# EAGLE design 30x70-motor-controller-0.2 (EAGLE 7.7.0)

## Sheet 1 of 2
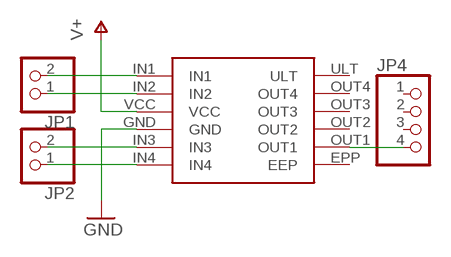
[diagram p0: schematic, sheet 1]

### Parts
JP1  PINHD-1X2/90  [1X02/90]
JP2  PINHD-1X2/90  [1X02/90]
JP4  PINHD-1X4/90  [1X04/90]
U$1  DRV8833-MODULE  [DRV8833-BRKOUT]

### Nets
GND: U$1.GND ; also sheet 2
N$1: JP2.2 U$1.IN3
N$2: JP2.1 U$1.IN4
N$3: JP1.2 U$1.IN1
N$4: JP1.1 U$1.IN2
N$14: JP4.4 U$1.OUT1
V+: U$1.VCC ; also sheet 2
Unconnected: JP4.1 JP4.2 JP4.3 U$1.EPP(EEP) U$1.OUT2 U$1.OUT3 U$1.OUT4 U$1.ULT

## Sheet 2 of 2
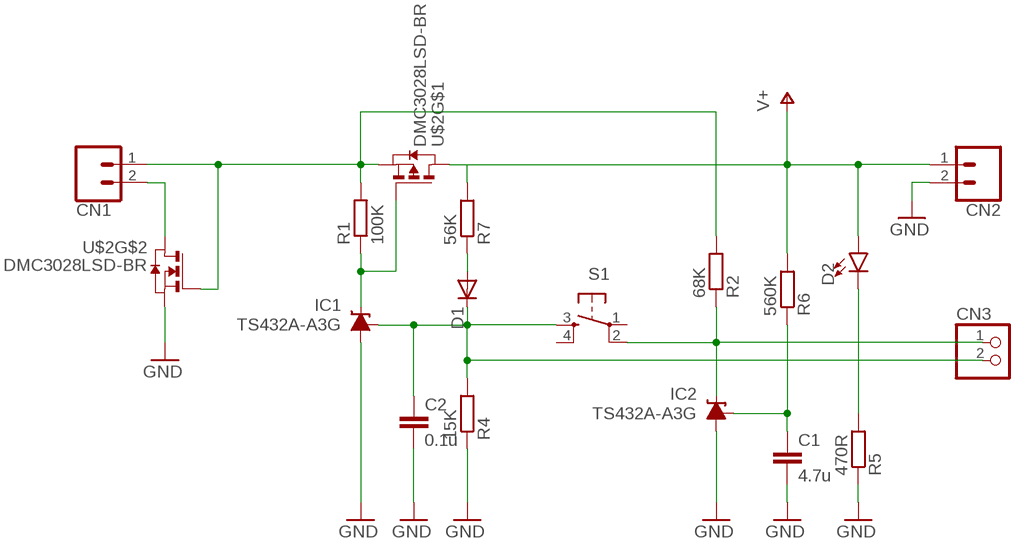
[diagram p1: schematic, sheet 2]

### Parts
C1  4.7u  C-EU025-025X050  [C025-025X050]
C2  0.1u  C-EU025-024X044  [C025-024X044]
CN1  CONN_02-JST-XTH  [JST-2-XTH]
CN2  CONN_02-JST-XTH  [JST-2-XTH]
CN3  PINHD-1X2/90  [1X02/90]
D1  DIODE-D-2.5  [D-2.5]
D2  LED-3MM-NO_SILK  [LED_3MM-NS]
IC1  TS432A-A3G  [TO92-LINE]
IC2  TS432A-A3G  [TO92-LINE]
R1  100K  R-EU_0204/2V  [0204V]
R2  68K  R-EU_0207/15  [0207/15]
R4  15K  R-EU_0204/2V  [0204V]
R5  470R  R-EU_0204/2V  [0204V]
R6  560K  R-EU_0204/2V  [0204V]
R7  56K  R-EU_0204/7  [0204/7]
S1  PROTO-MICRO-SWITCH  [B3F-10XX-PROTO]
U$2  DMC3028LSD-BR  [DIL8-BREAKOUT]

### Nets
GND: C1.2 C2.2 CN2.2 IC1.2(A) IC2.2(A) R4.1 R5.1 U$2.1(S) ; also sheet 1
N$5: CN1.1 R1.2 R2.2 U$2.2(G) U$2.3(S)
N$6: IC1.1(C) R1.1 U$2.4(G)
N$7: CN1.2 U$2.7(D) U$2.8(D)
N$8: C2.1 CN3.2 D1.C IC1.3(FB) R4.2 S1.3(S)
N$9: CN3.1 IC2.1(C) R2.1 S1.2(P1)
N$10: C1.1 IC2.3(FB) R6.1
N$13: D1.A R7.1
N$17: D2.K(C) R5.2
V+: CN2.1 D2.A R6.2 R7.2 U$2.5(D) U$2.6(D) ; also sheet 1
Unconnected: S1.1(P) S1.4(S1)

## Library data of the parts
C1 C2 = resistor:C-EU: CAPACITOR, European symbol
CN1 CN2 = assorted:CONN_02: Multi connection point. Often used as Generic Header-pin footprint for 0.1 inch spaced/style header connections On any of the 0.1 inch spaced packages, you can populate with these: Break Away Headers - Straight <https://www.sparkfun.com/products/116> (PRT-00116) Break Away Male Headers - Right Angle <https://www.sparkfun.com/products/553> (PRT-00553) Female Headers <https://www.sparkfun.com/products/115> (PRT-00115) Break Away Headers - Machine Pin <https://www.sparkfun.com/products/117> (PRT-00117) Break Away Female Headers - Swiss Machine Pin <https://www.sparkfun.com/products/743> (PRT-00743) For SCREWTERMINALS and SPRING TERMINALS visit here: Screw Terimnals on SparkFun.com <https://www.sparkfun.com/search/results?term=Screw+Terminals> (5mm/3.5mm/2.54mm spacing) This device is also useful as a general connection point to wire up your design to another part of your project. Our various solder wires solder well into these plated through hole pads. Hook-Up Wire - Assortment (Stranded, 22 AWG) <https://www.sparkfun.com/products/11375> (PRT-11375) Hook-Up Wire - Assortment (Solid Core, 22 AWG) <https://www.sparkfun.com/products/11367> (PRT-11367) View the entire wire category on our website here <https://www.sparkfun.com/categories/141> Special notes: Molex polarized connector foot print use with: PRT-08233 with associated crimp pins and housings. 2.54_SCREWTERM for use with PRT-10571. 3.5mm Screw Terminal footprints for PRT-08084 5mm Screw Terminal footprints for use with PRT-08432
CN3 JP1 JP2 = pinhead:PINHD-1X2: PIN HEADER
D1 = diode:DIODE-: DIODE
D2 = SparkFun-LED:LED: LED (Generic) Standard schematic elements and footprints for 5mm, 3mm, 1206, and 0603 sized LEDs. Generic LEDs with no color specified.
IC1 IC2 = assorted:TS432A: Shunt regulator 1.24V 1% 0.8uA-100mA 18V
JP4 = pinhead:PINHD-1X4: PIN HEADER
R1 R2 R4-R7 = resistor:R-EU_: RESISTOR, European symbol
S1 = assorted:PROTO-MICRO-SWITCH: OMRON SWITCH
U$1 = assorted:DRV8833-MODULE
U$2 = assorted:DMC3028LSD

## Board
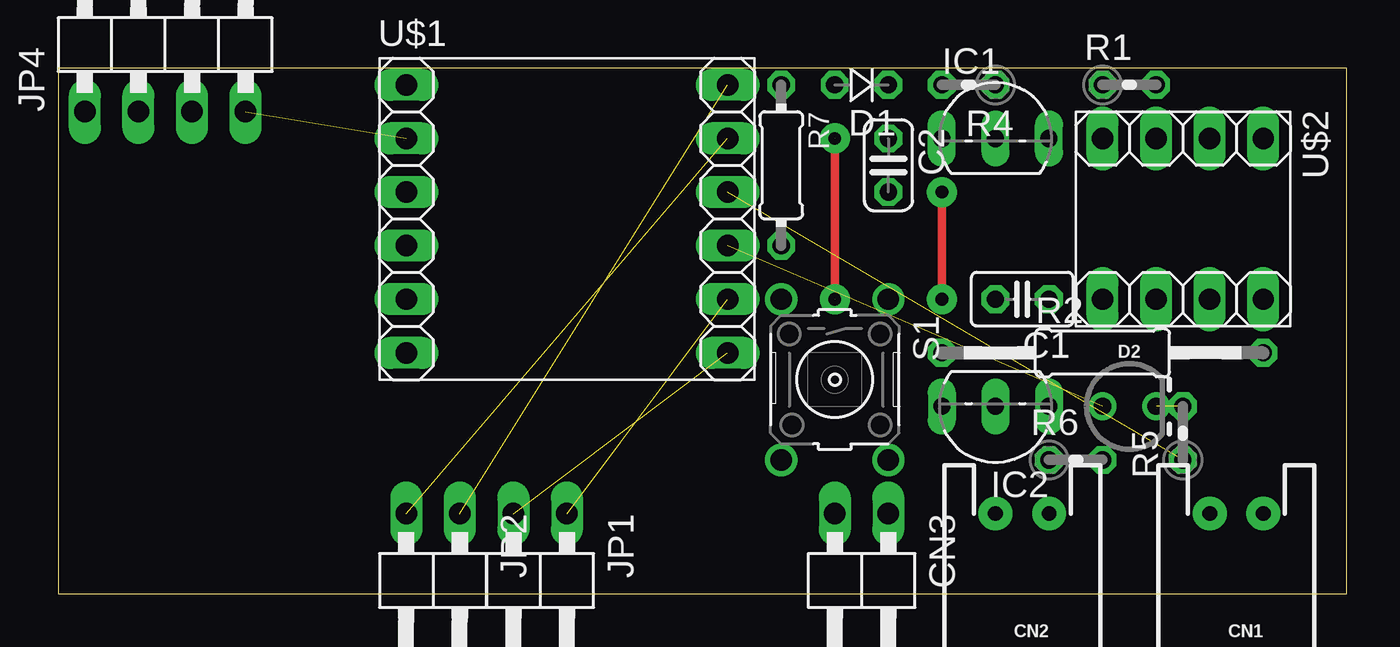
[diagram p2: board, top side]
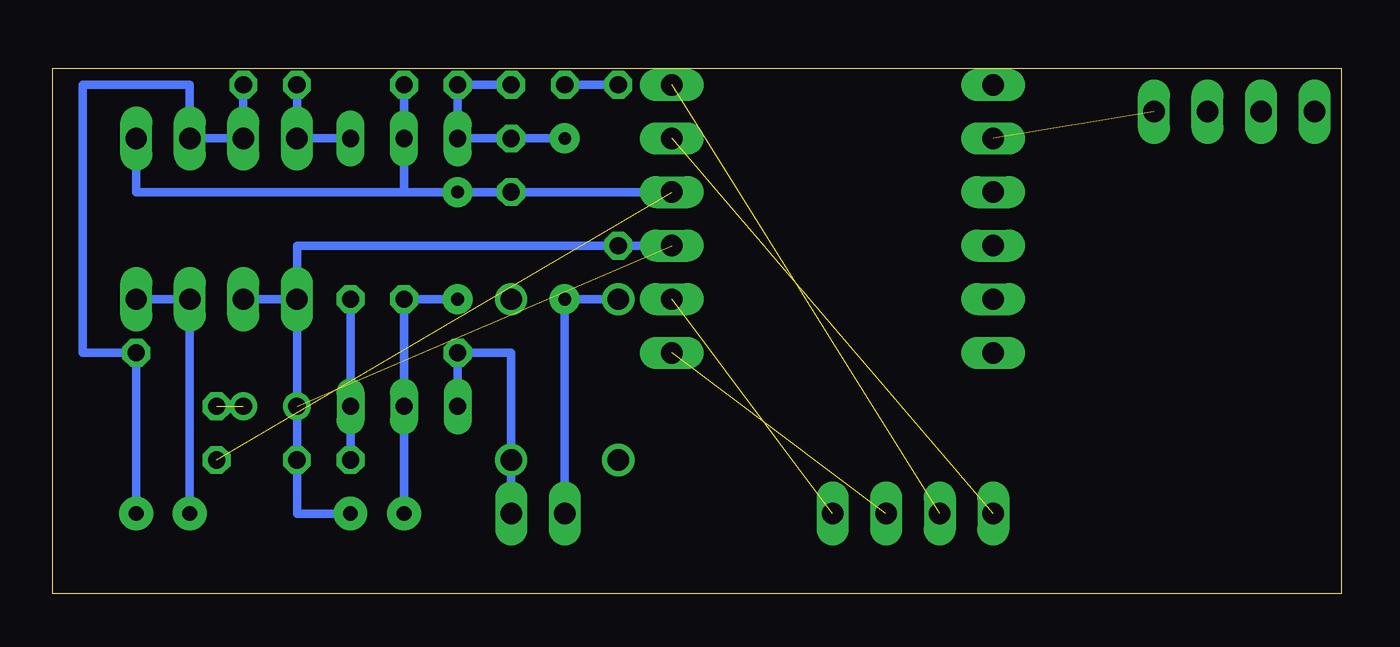
[diagram p3: board, bottom side, seen from below]

Size 61.11 x 24.92 mm. Coordinates in mm from the lower left corner, seen from the top.
Outline: 0,0 61.11,0 61.11,24.92 0,24.92 0,0
Copper layers (1*16): Top 0.035mm / dielectric 1.5mm / Bottom 0.035mm
Design rules "default": minimum track width 10mil, minimum drill 24mil, track to track 8mil, track to pad 8mil, pad to pad 8mil, via to via 8mil, smd to smd 8mil, copper to edge 40mil, drill to drill 8mil, minimum pad ring 10mil, minimum via ring 8mil, stop-mask expansion 4mil, vias tented up to drill 0mil, thermal gap 10mil

### Footprints (pad centres in the part's own frame; a part is rotated, then mirrored left to right if it is on the bottom)
C025-025X050 = drill 0.813 octagon: 1 -1.27,0; 2 1.27,0
C025-024X044 = drill 0.813 octagon: 1 -1.27,0; 2 1.27,0
JST-2-XTH = drill 0.7 pad 1.6: 1 -1.27,0; 2 1.27,0
1X02/90 = drill 1.016 long: 1 -1.27,-3.81; 2 1.27,-3.81
D-2.5 = drill 0.813 octagon: A 1.27,0; C -1.27,0
LED_3MM-NS = drill 0.813: A -1.27,0; K 1.27,0
TO92-LINE = drill 0.813 long: 1 2.54,0; 2 0,0; 3 -2.54,0
1X04/90 = drill 1.016 long: 1 -3.81,-3.81; 2 -1.27,-3.81; 3 1.27,-3.81; 4 3.81,-3.81
0204V = drill 0.813 octagon: 1 -1.27,0; 2 1.27,0
0207/15 = drill 0.813 octagon: 1 -7.62,0; 2 7.62,0
0204/7 = drill 0.813 octagon: 1 -3.81,0; 2 3.81,0
B3F-10XX-PROTO = drill 1.016: 1 -3.81,2.54; 2 3.81,2.54; 3 -3.81,-2.54; 4 3.81,-2.54
DRV8833-BRKOUT = drill 1.016 long: EPP -7.62,6.35; GND 7.62,1.27; IN1 7.62,-6.35; IN2 7.62,-3.81; IN3 7.62,3.81; IN4 7.62,6.35; OUT1 -7.62,3.81; OUT2 -7.62,1.27; OUT3 -7.62,-1.27; OUT4 -7.62,-3.81; ULT -7.62,-6.35; VCC 7.62,-1.27
DIL8-BREAKOUT = drill 1.016 long: 1 -3.81,3.81; 2 -3.81,1.27; 3 -3.81,-1.27; 4 -3.81,-3.81; 5 3.81,-3.81; 6 3.81,-1.27; 7 3.81,1.27; 8 3.81,3.81

### Placement (x,y rotation side)
C1  45.72,13.97 180 top
C2  39.37,20.32 270 top
CN1  55.88,3.81 180 top
CN2  45.72,3.81 180 top
CN3  38.1,0 180 top
D1  38.1,24.13 180 top
D2  50.8,8.89 0 top
IC1  44.45,21.59 0 top
IC2  44.45,8.89 180 top
JP1  22.86,0 180 top
JP2  17.78,0 180 top
JP4  5.08,26.67 0 top
R1  50.8,24.13 0 top
R2  49.53,11.43 0 top
R4  43.18,24.13 180 top
R5  53.34,7.62 90 top
R6  48.26,6.35 0 top
R7  34.29,20.32 270 top
S1  36.83,10.16 270 top
U$1  24.13,17.78 0 top
U$2  53.34,17.78 270 top

### Tracks (layer width: path | path; a pad name or v marks a point on that pad's centre or on a via)
GND  (via drill 0.6 pad 1.42)  (1 unrouted)
  Top 0.406: v41.91,19.05 v41.91,13.97
  Bottom 0.406: U$2.1 57.15,19.05 v41.91,19.05 C2.2 | C2.2 44.45,19.05 IC1.2 R4.1 | CN2.2 IC2.2 C1.2 v41.91,13.97 | U$1.GND C2.2
N$1  (1 unrouted)
N$2  (1 unrouted)
N$3  (1 unrouted)
N$4  (1 unrouted)
N$5
  Bottom 0.406: R1.2 U$2.3 U$2.2 54.61,24.13 59.69,24.13 59.69,11.43 R2.2 CN1.1
N$6
  Bottom 0.406: R1.1 U$2.4 IC1.1
N$7
  Bottom 0.406: U$2.8 U$2.7 CN1.2
N$8  (2 unrouted)
  Top 0.406: 36.83,21.59 36.83,13.97
  Bottom 0.406: D1.C R4.2 IC1.3 C2.1 36.83,21.59 | S1.3 36.83,13.97 CN3.2
N$9
  Bottom 0.406: IC2.1 R2.1 39.37,11.43 S1.2 CN3.1
N$10
  Bottom 0.406: C1.1 R6.1 IC2.3
N$13
  Bottom 0.406: R7.1 D1.A
N$14  (1 unrouted)
N$17  (1 unrouted)
N$22  (via drill 0.6 pad 1.42)
  other vias: 36.83,21.59
N$23  (via drill 0.6 pad 1.42)
  other vias: 36.83,13.97
V+  (1 unrouted)
  Bottom 0.406: R6.2 U$2.5 | U$2.5 49.53,16.51 R7.2 U$1.VCC | U$2.6 U$2.5 | U$2.5 49.53,3.81 CN2.1